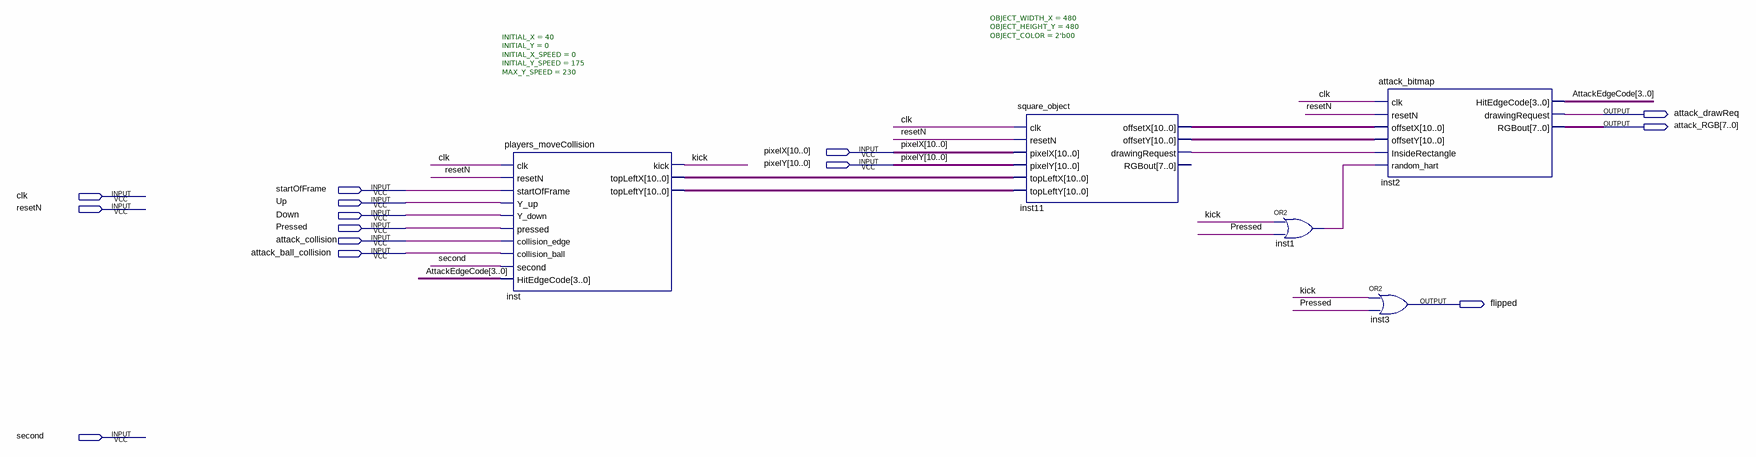
[diagram p0: schematic sheet]
// Quartus schematic attack_block.bdf as structural Verilog: 5 symbols, 14 pins
module attack_block (
  input  [10:0] pixelX,
  input  [10:0] pixelY,
  input  startOfFrame,
  input  clk,
  input  Up,
  input  resetN,
  input  Down,
  input  Pressed,
  input  attack_collision,
  input  attack_ball_collision,
  input  second,
  output attack_drawReq,
  output [7:0] attack_RGB,
  output flipped
);

  wire inst1_out, inst11_drawingrequest, kick;
  wire [3:0] AttackEdgeCode;
  wire [10:0] inst11_offsetx, inst11_offsety, inst_topleftx, inst_toplefty;

  players_moveCollision #(.INITIAL_X(40), .INITIAL_Y(0), .INITIAL_X_SPEED(0), .INITIAL_Y_SPEED(175), .MAX_Y_SPEED(230)) inst (
    .clk(clk), .resetN(resetN), .startOfFrame(startOfFrame), .Y_up(Up), .Y_down(Down), .pressed(Pressed),
    .collision_edge(attack_collision), .collision_ball(attack_ball_collision), .second(second),
    .HitEdgeCode(AttackEdgeCode), .kick(kick), .topLeftX(inst_topleftx), .topLeftY(inst_toplefty));
  square_object #(.OBJECT_WIDTH_X(480), .OBJECT_HEIGHT_Y(480), .OBJECT_COLOR(2'b00)) inst11 (
    .clk(clk), .resetN(resetN), .pixelX(pixelX), .pixelY(pixelY), .topLeftX(inst_topleftx),
    .topLeftY(inst_toplefty), .offsetX(inst11_offsetx), .offsetY(inst11_offsety),
    .drawingRequest(inst11_drawingrequest));  // open: RGBout
  or inst1 (inst1_out, kick, Pressed);
  attack_bitmap inst2 (
    .clk(clk), .resetN(resetN), .offsetX(inst11_offsetx), .offsetY(inst11_offsety),
    .InsideRectangle(inst11_drawingrequest), .random_hart(inst1_out), .HitEdgeCode(AttackEdgeCode),
    .drawingRequest(attack_drawReq), .RGBout(attack_RGB));
  or inst3 (flipped, kick, Pressed);
endmodule
